# Altium schematic sheet Sheet1.SchDoc
size A
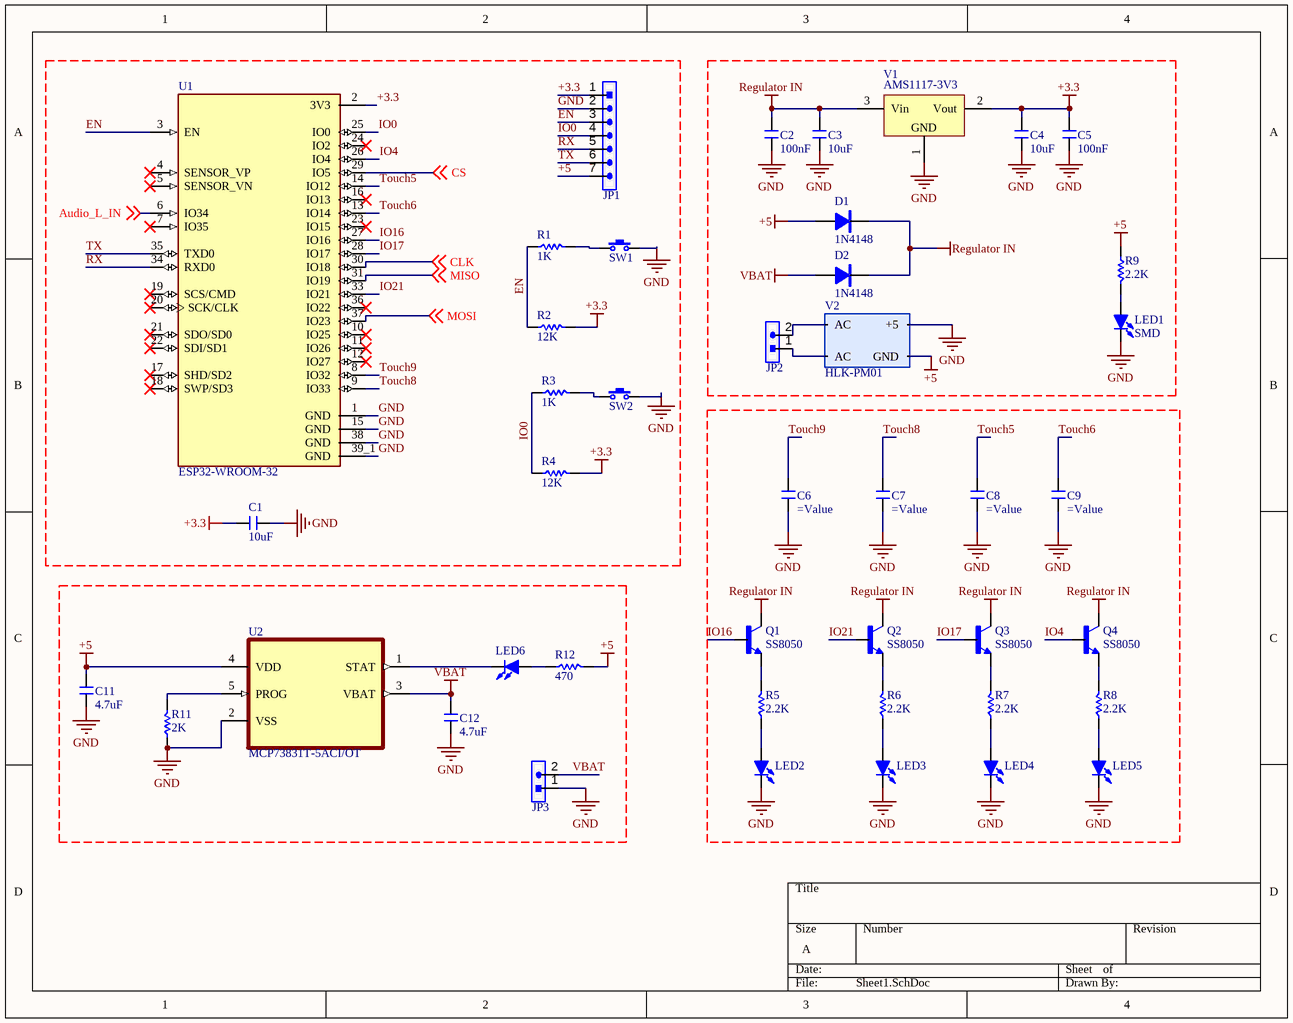
[diagram p0: Sheet1.SchDoc]

## Parts
C1  10uF  [C 0805]
C2  100nF  [C 0805]
C3  10uF  [C 0805]
C4  10uF  [C 0805]
C5  100nF  [C 0805]
C6  (no value)  [C 0805]
C7  (no value)  [C 0805]
C8  (no value)  [C 0805]
C9  (no value)  [C 0805]
C11  4.7uF  [C 0805]
C12  4.7uF  [C 0805]
D1  1N4148  [MINI_MELF (LL34)]
D2  1N4148  [MINI_MELF (LL34)]
JP1  HDR-1X7  [HDR-1X7]  (value not drawn)
JP2  HDR-1X2  [KF2EDGK-2P]  (value not drawn)
JP3  HDR-1X2  [HDR-1X2]  (value not drawn)
LED1  SMD  [LED 0805R]
LED2  (no value)  [LED 5MM-B]
LED3  (no value)  [LED 5MM-B]
LED4  (no value)  [LED 5MM-B]
LED5  (no value)  [LED 5MM-B]
LED6  LED-SMD  [LED 0805G]  (value not drawn)
Q1  SS8050  [SOT23-BEC]
Q2  SS8050  [SOT23-BEC]
Q3  SS8050  [SOT23-BEC]
Q4  SS8050  [SOT23-BEC]
R1  1K  [R 0805]
R2  12K  [R 0805]
R3  1K  [R 0805]
R4  12K  [R 0805]
R5  2.2K  [R 0805]
R6  2.2K  [R 0805]
R7  2.2K  [R 0805]
R8  2.2K  [R 0805]
R9  2.2K  [R 0805]
R11  2K  [R 0805]
R12  470  [R 0805]
SW1  3x6x5  [TSW SMD-3*6*2.5]  (value not drawn)
SW2  3x6x5  [TSW SMD-3*6*2.5]  (value not drawn)
U1  ESP32-WROOM-32  [MODULE_ESP32-WROOM-32]
U2  MCP73831T-5ACI/OT  [SOT95P280X145-5N]
V1  AMS1117-3V3  [SOT223_L]
V2  HLK-PM01  [HLKPM01]

## Nets
+3.3: C1.2 C4.2 C5.2 JP1.1 R2.2 R4.2 U1.2(3V3) V1.2(Vout)
+5: C11.2 D1.1(A) JP1.7 R9.1 R12.2 U2.4(VDD) V2.4(GND)
GND: C1.1 C2.1 C3.1 C4.1 C5.1 C6.1 C7.1 C8.1 C9.1 C11.1 C12.1 JP1.2 JP3.1 LED1.2(K) LED2.2(K) LED3.2(K) LED4.2(K) LED5.2(K) R11.1 SW1.2 SW2.2 U1.1(GND) U1.15(GND) U1.38(GND) U1.39_1(GND) U2.2(VSS) V1.1(GND) V2.3(+5)
Regulator IN: C2.2 C3.2 D1.2(K) D2.2(K) Q1.C Q2.C Q3.C Q4.C V1.3(Vin)
VBAT: C12.2 D2.1(A) JP3.2 U2.3(VBAT)
Audio_L_IN: U1.6(IO34) ; off-sheet Audio_L_IN
CLK: U1.30(IO18) ; off-sheet CLK
CS: U1.29(IO5) ; off-sheet CS
EN: JP1.3 R1.1 R2.1 U1.3(EN)
IO0: JP1.4 R3.1 R4.1 U1.25(IO0)
IO4: Q4.B U1.26(IO4)
IO16: Q1.B U1.27(IO16)
IO17: Q3.B U1.28(IO17)
IO21: Q2.B U1.33(IO21)
MISO: U1.31(IO19) ; off-sheet MISO
MOSI: U1.37(IO23) ; off-sheet MOSI
RX: JP1.5 U1.34(RXD0)
Touch5: C8.2 U1.14(IO12)
Touch6: C9.2 U1.13(IO14)
Touch8: C7.2 U1.9(IO33)
Touch9: C6.2 U1.8(IO32)
TX: JP1.6 U1.35(TXD0)
NetJP2_1: JP2.1 V2.2(AC)
NetJP2_2: JP2.2 V2.1(AC)
NetLED1_1: LED1.1(A) R9.2
NetLED2_1: LED2.1(A) R5.1
NetLED3_1: LED3.1(A) R6.1
NetLED4_1: LED4.1(A) R7.1
NetLED5_1: LED5.1(A) R8.1
NetLED6_1: LED6.1(A) R12.1
NetLED6_2: LED6.2(K) U2.1(STAT)
NetQ1_E: Q1.E R5.2
NetQ2_E: Q2.E R6.2
NetQ3_E: Q3.E R7.2
NetQ4_E: Q4.E R8.2
NetR1_2: R1.2 SW1.1
NetR3_2: R3.2 SW2.1
NetR11_2: R11.2 U2.5(PROG)

Not connected (* = marked no-connect by the designer): U1 4(SENSOR_VP)* 5(SENSOR_VN)* 7(IO35)* 10(IO25)* 11(IO26)* 12(IO27)* 16(IO13)* 17(SHD/SD2)* 18(SWP/SD3)* 19(SCS/CMD)* 20(SCK/CLK)* 21(SDO/SD0)* 22(SDI/SD1)* 23(IO15)* 24(IO2)* 36(IO22)*

## Library data of the parts
C1-C9 C11 C12 = C: Non-polar patch capacitor; BOM名称: 无极性贴片电容; 版权归属: 源创客; 学习资源: www.ooocke.com
D1 D2 = 1N4148: High speed switching diode; BOM名称: 高速开关二极管; 版权归属: 源创客; 学习资源: www.ooocke.com
JP1 = Header 7: 7P Connector; BOM名称: 7P接插件; 版权归属: 源创客; 学习资源: www.ooocke.com
JP2 JP3 = Header 2: 2P Connector; BOM名称: 2P接插件; 版权归属: 源创客; 学习资源: www.ooocke.com
LED1 = LED-SMD: RED LED; BOM名称: 贴片LED; 版权归属: 源创客; 学习资源: www.ooocke.com
LED2-LED5 = LED-5MM: 5mm plug-in LED; BOM名称: 5mm插件LED; 版权归属: 源创客; 学习资源: www.ooocke.com
LED6 = LED-SMD: Patch LED; BOM名称: 贴片LED; 版权归属: 源创客; 学习资源: www.ooocke.com
Q1-Q4 = BCW31*: Bipolar _BJT_ Transistor NPN General Purpose Amplifier Surface Mount; MF: ON Semiconductor; MP: BCW31; Package: SOT-23 ON Semiconductor; Value: *; Availability: Unavailable; SnapEDA_Link: https://www.snapeda.com/parts/BCW31/ON%20Semiconductor/view-part/573820/?ref=snap; Price: None
R1-R9 R11 R12 = R: Chip resistor; 版权归属: 源创客; BOM名称: Chip resistor; 学习资源: www.ooocke.com
SW1 SW2 = TSW 3x6: 3x6 tact switch; BOM名称: 3x6轻触开关; 版权归属: 源创客; 学习资源: www.ooocke.com
U1 = ESP32-WROOM-32: Bluetooth, WiFi Transceiver Module 2.4GHz ~ 2.5GHz Surface Mount; MF: Espressif Systems; Package: Module Espressif Systems; Digi-Key_Part_Number: 1904-1010-1-ND; Digi-Key_Purchase_URL: https://www.digikey.com/product-detail/en/espressif-systems/ESP32-WROOM-32/1904-1010-1-ND/8544305?utm_source=snapeda&utm_medium=aggregator&utm_campaign=symbol; Value: *; MP: ESP32-WROOM-32; SnapEDA_Link: https://www.snapeda.com/parts/ESP32-WROOM-32/Espressif%20Systems/view-part/2753322/?ref=snap
U2 = MCP73831T-5ACI/OT: Charger IC Lithium Ion/Polymer SOT-23-5; MF: Microchip; MP: MCP73831T-5ACI/OT; Package: SOT-23-5 Microchip; SnapEDA_Link: https://www.snapeda.com/parts/MCP73831T-5ACI/OT/Microchip/view-part/1037579/?ref=snap; Availability: Unavailable; Price: None; Value: *
V1 = AMS1117: Three-terminal regulator chip; BOM名称: 稳压芯片; 版权归属: 源创客; 学习资源: www.ooocke.com
V2 = HLK-PM01: <b>Ultra-compact power module</b><p> Source: <a href="https://datasheet.lcsc.com/szlcsc/1906201102_HI-LINK-HLK-PM03_C209904.pdf"> Datasheet </a>; Package: Package Analog Devices; MF: Hi-link; Availability: Unavailable; Value: *; MP: hlk-pm01; Price: None; SnapEDA_Link: https://www.snapeda.com/parts/hlk-pm01/Hi-link/view-part/2875605/?ref=snap